# EasyEDA Pro project ProPrj_STM32_extender.epro

# Schematic Schematic1
Board Name: Board1; Create Date: 2024-09-02
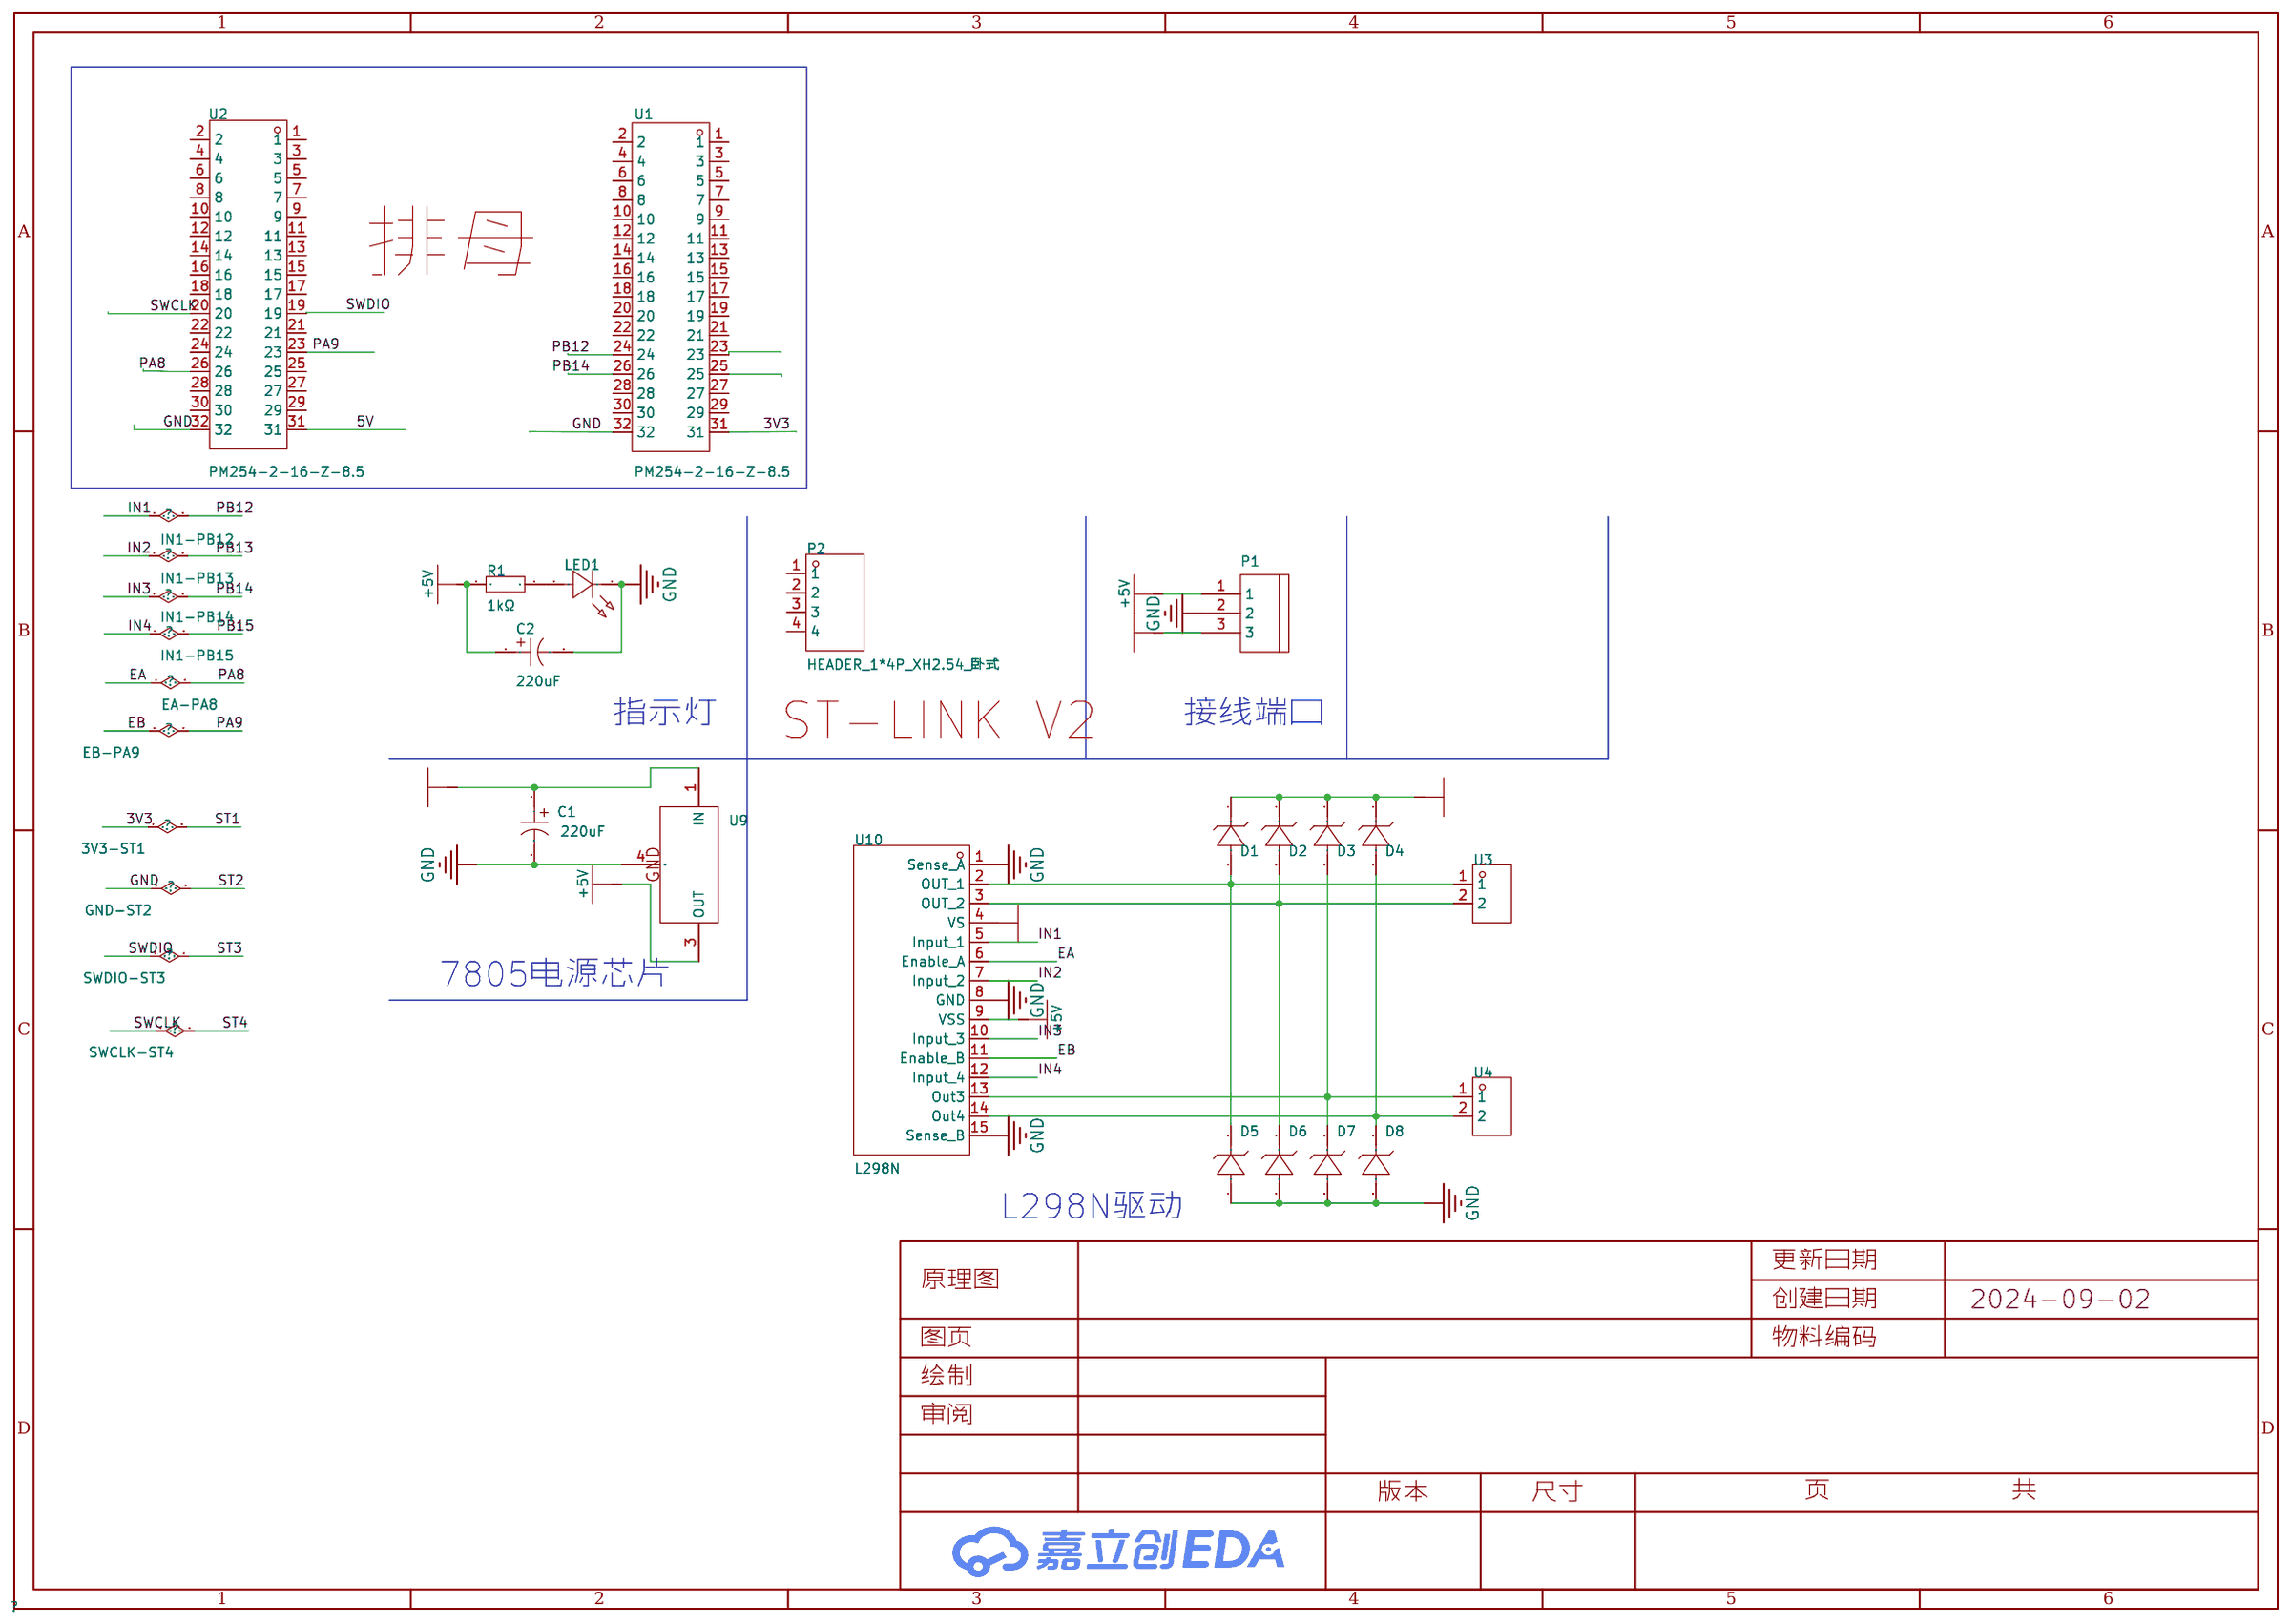
[diagram p0: schematic sheet]

## Parts
C1  220uF  [CAP-SMD_BD8.0-L8.3-W8.3-LS9.3-FD]
C2  220uF  [CAP-SMD_BD8.0-L8.3-W8.3-LS9.3-FD]
D1  -  [SOD-123FL_L2.7-W1.8-LS3.8-RD]
D2  -  [SOD-123FL_L2.7-W1.8-LS3.8-RD]
D3  -  [SOD-123FL_L2.7-W1.8-LS3.8-RD]
D4  -  [SOD-123FL_L2.7-W1.8-LS3.8-RD]
D5  -  [SOD-123FL_L2.7-W1.8-LS3.8-RD]
D6  -  [SOD-123FL_L2.7-W1.8-LS3.8-RD]
D7  -  [SOD-123FL_L2.7-W1.8-LS3.8-RD]
D8  -  [SOD-123FL_L2.7-W1.8-LS3.8-RD]
LED1  -  [LED0805-RD_BLUE]
P1  -  [CONN-TH_3P-P5.00_WJ500V-5.08-3P]
P2  HEADER_1*4P_XH2.54_卧式  [HDR-TH_4P-P2.54-H-M-W11.0]
R1  1kΩ  [R0805]
U1  PM254-2-16-Z-8.5  [HDR-TH_32P-P2.54-V-F-R2-C16-S2.54]
U2  PM254-2-16-Z-8.5  [HDR-TH_32P-P2.54-V-F-R2-C16-S2.54]
U3  -  [CONN-TH_DB302-5.0-2P]
U4  -  [CONN-TH_DB302-5.0-2P]
U9  L78M05ABDT-TR  [TO-252-2_L6.5-W6.1-P4.58-LS10.0-TL]
U10  L298N  [MULTIWATT-15_L19.6-W5.0-P1.27-L]

## Library data of the parts
C1 C2 = EMK1VM221FB0D00R: 容值:220uF;精度:±20%;额定电压:35V;电容体直径:-;电容体长度:-;纹波电流:-;等效串联电阻:-;工作寿命:-;工作温度:-;; LCSC Part Name: 220uF ±20% 35V; Supplier Part: C724731; Manufacturer: AISHI(艾华集团); Supplier Footprint: SMD,8x10.5mm; JLCPCB Part Class: Extended Part; Datasheet: https://atta.szlcsc.com/upload/public/pdf/source/20200818/C724731_E3C3C738DF50876976EE53B5D20E1717.pdf; Supplier: LCSC; Tolerance: ±20%; Rated Voltage: 35V
D1-D8 = 1N4007: 二极管配置:独立式;直流反向耐压(Vr):1kV;平均整流电流(Io):1A;正向压降(Vf):1.1V@1A;反向电流(Ir):10A@1kV;; LCSC Part Name: 1kV 1A 1.1V@1A; Supplier Part: C727082; Manufacturer: TWGMC(台湾迪嘉); Supplier Footprint: SOD-123FL; JLCPCB Part Class: Extended Part; Datasheet: https://atta.szlcsc.com/upload/public/pdf/source/20200828/C727082_2F914037E829F0E2238583225D7ED281.pdf; Supplier: LCSC; Diode Configuration: 独立式; Reverse Voltage (Vr): 1kV; Average Rectified Current (Io): 1A; Forward Voltage (Vf@If): 1.1V@1A; Reverse Leakage Current: 10A@1kV
LED1 = RF-BGB170TS-CB-E0: 发光颜色:蓝灯;二极管配置:-;透镜颜色:-;主波长:-;峰值波长:-;色温:-;光通量(25时):-;测试电流:20mA;正向电压(VF):-;发光强度:-;功率:70mW;发光角度:140°;安装方式:正贴;工作温度:-40~+85;; LCSC Part Name: 蓝灯 正贴; Supplier Part: C2908306; Manufacturer: Refond(瑞丰); Supplier Footprint: 0805; JLCPCB Part Class: Extended Part; Datasheet: https://atta.szlcsc.com/upload/public/pdf/source/20211101/C871A18E9B6E101B84BDF0C661245F86.pdf; Supplier: LCSC; Emitted Color: 蓝灯; Forward Current: 20mA; Power Dissipation: 70mW; Viewing Angle: 140°; Mounting Sytle: 正贴; Operating Temperature: -40~+85
P1 = WJ500V-5.08-3P: 间距:5.08mm;排数:1;每排PIN数:3;安装方式:直针;额定电流:18A;额定电压:250V;线规 - AWG:14~30;线规 - mm?:2.5;工作温度范围:-40~+105;颜色:绿色;; LCSC Part Name: 5.08mm 排数:1 每排P数:3 直针 可拼接; Supplier Part: C72334; Manufacturer: KANGNEX(康奈克斯电气); Supplier Footprint: P=5.08mm; JLCPCB Part Class: Extended Part; Datasheet: https://atta.szlcsc.com/upload/public/pdf/source/20191225/C72334_8A5EF831D67650233B6B1E3F2BC06274.pdf; Supplier: LCSC; Pitch: 5.08mm; Number of Rows: 1; Number of PINs Per Row: 3; Mounting Style: 直针; Current Rating (Max): 18A; Voltage Rating (Max): 250V; Wire Gauge - AWG: 14~30; Wire Gauge - mm?: 2.5; Operating Temperature Range: -40~+105; Color: 绿色
P2 = HEADER_1*4P_XH2.54_卧式: Supplier Part: C9900003188; Supplier Footprint: ST-Link; JLCPCB Part Class: 扩展库; Supplier: LCSC
R1 = RS-05K102JT: 阻值:1kΩ;精度:±5%;功率:125mW;温度系数:±100ppm/;最大工作电压:150V;工作温度范围:-55~+155;; LCSC Part Name: 1kΩ ±5%; Supplier Part: C115302; Manufacturer: FH(风华); Supplier Footprint: 0805; JLCPCB Part Class: Extended Part; Datasheet: https://atta.szlcsc.com/upload/public/pdf/source/20170704/1499151304704.pdf; Supplier: LCSC; Tolerance: ±5%; Power(Watts): 125mW; Temperature Coefficient: ±100ppm/; Overload Voltage (Max): 150V; Operating Temperature Range: -55~+155
U1 U2 = PM254-2-16-Z-8.5: 插孔结构:2x16P;间距:2.54mm;行距:2.54mm;圆孔/方孔:方孔;安装类型:直插;排数:双排;总孔位数:32P;额定电流:3A;额定电压:-;插孔方向:顶部;塑高:8.5mm;触头材质:铜合金;工作温度范围:-40℃~+105℃;焊接温度(最大值):260℃@5S;; LCSC Part Name: 2x16P 间距:2.54mm 直插; Supplier Part: C2897417; Manufacturer: HCTL(华灿天禄); Supplier Footprint: 插件,P=2.54mm; JLCPCB Part Class: 扩展库; Datasheet: https://atta.szlcsc.com/upload/public/pdf/source/20230609/3D36CA2C1BFC9FD1C3F709AD9DFEB9C2.pdf; Supplier: LCSC; Holes Structure: 2x16P; Pitch: 2.54mm; Row Spacing: 2.54mm; Circular Hole / Square Hole: 方孔; Mounting Type: 直插; Number of Rows: 双排; Number of Holes: 32P; Current Rating (Max): 3A; Holes Direction: 顶部; Insulation Height: 8.5mm; Contact Material: 铜合金; Operating Temperature Range: -40℃~+105℃; Soldering Temperature(Max): 260℃@5S
U3 U4 = DB302-5.0-2P-GN-S: LCSC Part Name: 2P P=5mm; Supplier Part: C2997275; Manufacturer: DIBO(地博电气); Supplier Footprint: P=5mm; JLCPCB Part Class: Extended Part; Datasheet: https://atta.szlcsc.com/upload/public/pdf/source/20220418/F63E4822E301FF035E2D9136E480A4B5.pdf; Supplier: LCSC
U9 = L78M05ABDT-TR: L78M Series 500 mA 5 V Three Terminal Positive Voltage LDO Regulator - TO-252; Supplier Part: C58069; Manufacturer: ST(意法半导体); Supplier Footprint: TO-252-2(DPAK); JLCPCB Part Class: Basic Part; Datasheet: https://atta.szlcsc.com/upload/public/pdf/source/20150912/1457707362652.pdf; Supplier: LCSC
U10 = L298N_C19922: 电源电压:4.5V~7V;特性:过流保护(OCP)；过热保护(OPT);; Supplier Part: C19922; Manufacturer: ST(意法半导体); Supplier Footprint: Multiwatt-15-V; JLCPCB Part Class: Extended Part; Datasheet: https://atta.szlcsc.com/upload/public/pdf/source/20131014/1457706655076.pdf; Supplier: LCSC; Supply Voltage: 4.5V~7V; Feature: 过流保护(OCP)；过热保护(OPT); Operating Temperature: -40℃~+150℃@(Tj)

## Nets
3V3: U1.31
5V: U2.31
12V: C1.1 D1.1(K) D2.1(K) D3.1(K) D4.1(K) P1.3 U9.1(IN) U10.4(VS)
+5V: C2.1 P1.1 R1.2 U9.3(OUT) U10.9(VSS)
GND: C1.2 C2.2 D5.2(A) D6.2(A) D7.2(A) D8.2(A) LED1.1(K) P1.2 U1.32 U2.32 U9.4(GND) U10.1(Sense A) U10.8(GND) U10.15(Sense B)
EA: U2.26 U10.6(Enable A)
EB: U2.23 U10.11(Enable B)
IN1: U1.24 U10.5(Input 1)
IN2: U10.7(Input 2)
IN3: U1.26 U10.10(Input 3)
IN4: U10.12(Input 4)
ST3: U2.19
ST4: U2.20
$1N2794: D3.2(A) D7.1(K) U4.1 U10.13(Out3)
$1N2795: D4.2(A) D8.1(K) U4.2 U10.14(Out4)
$1N2797: D1.2(A) D5.1(K) U3.1 U10.2(OUT 1)
$1N2798: D2.2(A) D6.1(K) U3.2 U10.3(OUT 2)
$1N2826: LED1.2(A) R1.1

Not connected (* = marked no-connect by the designer): P2 1 2 3 4; U1 1 2 3 4 5 6 7 8 9 10 11 12 13 14 15 16 17 18 19 20 21 22 23 25 27 28 29 30; U2 1 2 3 4 5 6 7 8 9 10 11 12 13 14 15 16 17 18 21 22 24 25 27 28 29 30

## Notes on the sheet
- 排母
- 指示灯
- 接线端口
- ST-LINK V2
- 7805电源芯片
- L298N驱动

# Board PCB1
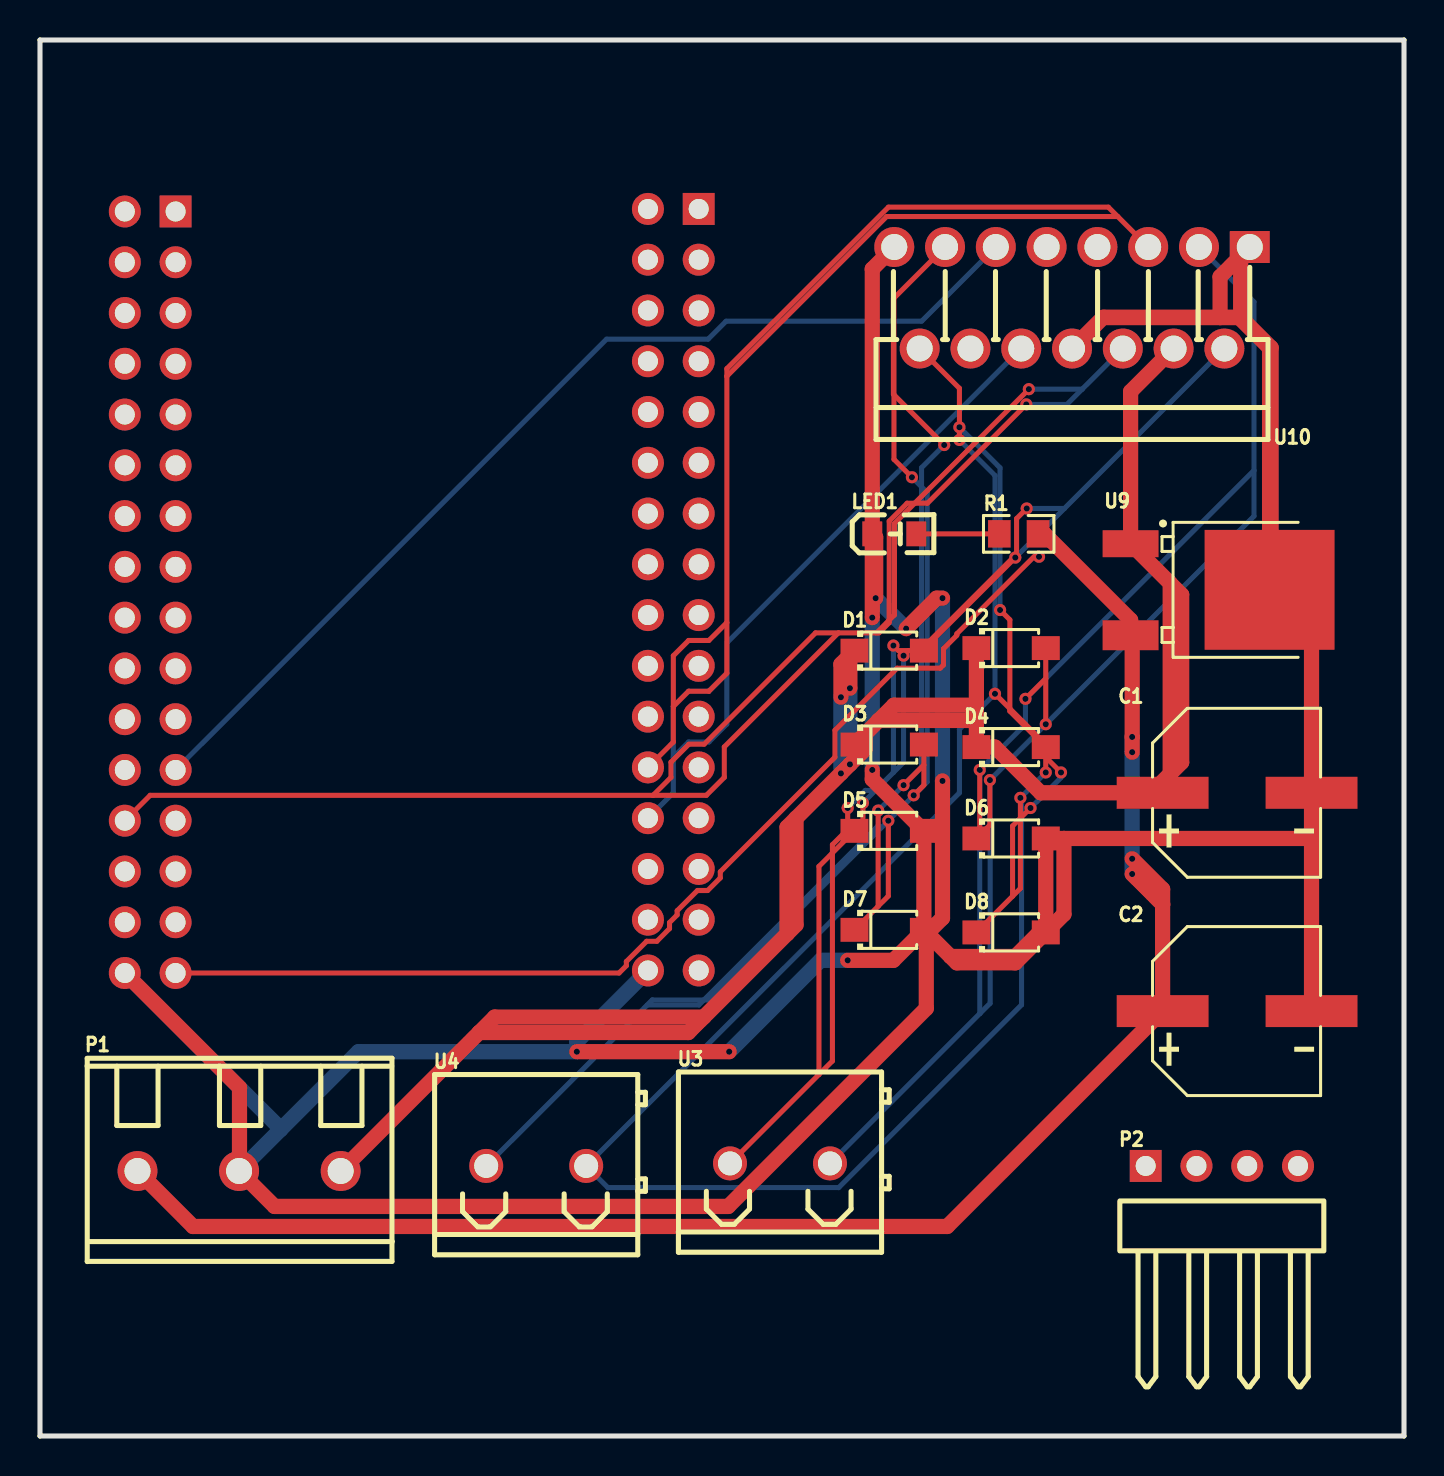
[diagram p1: board, top side]
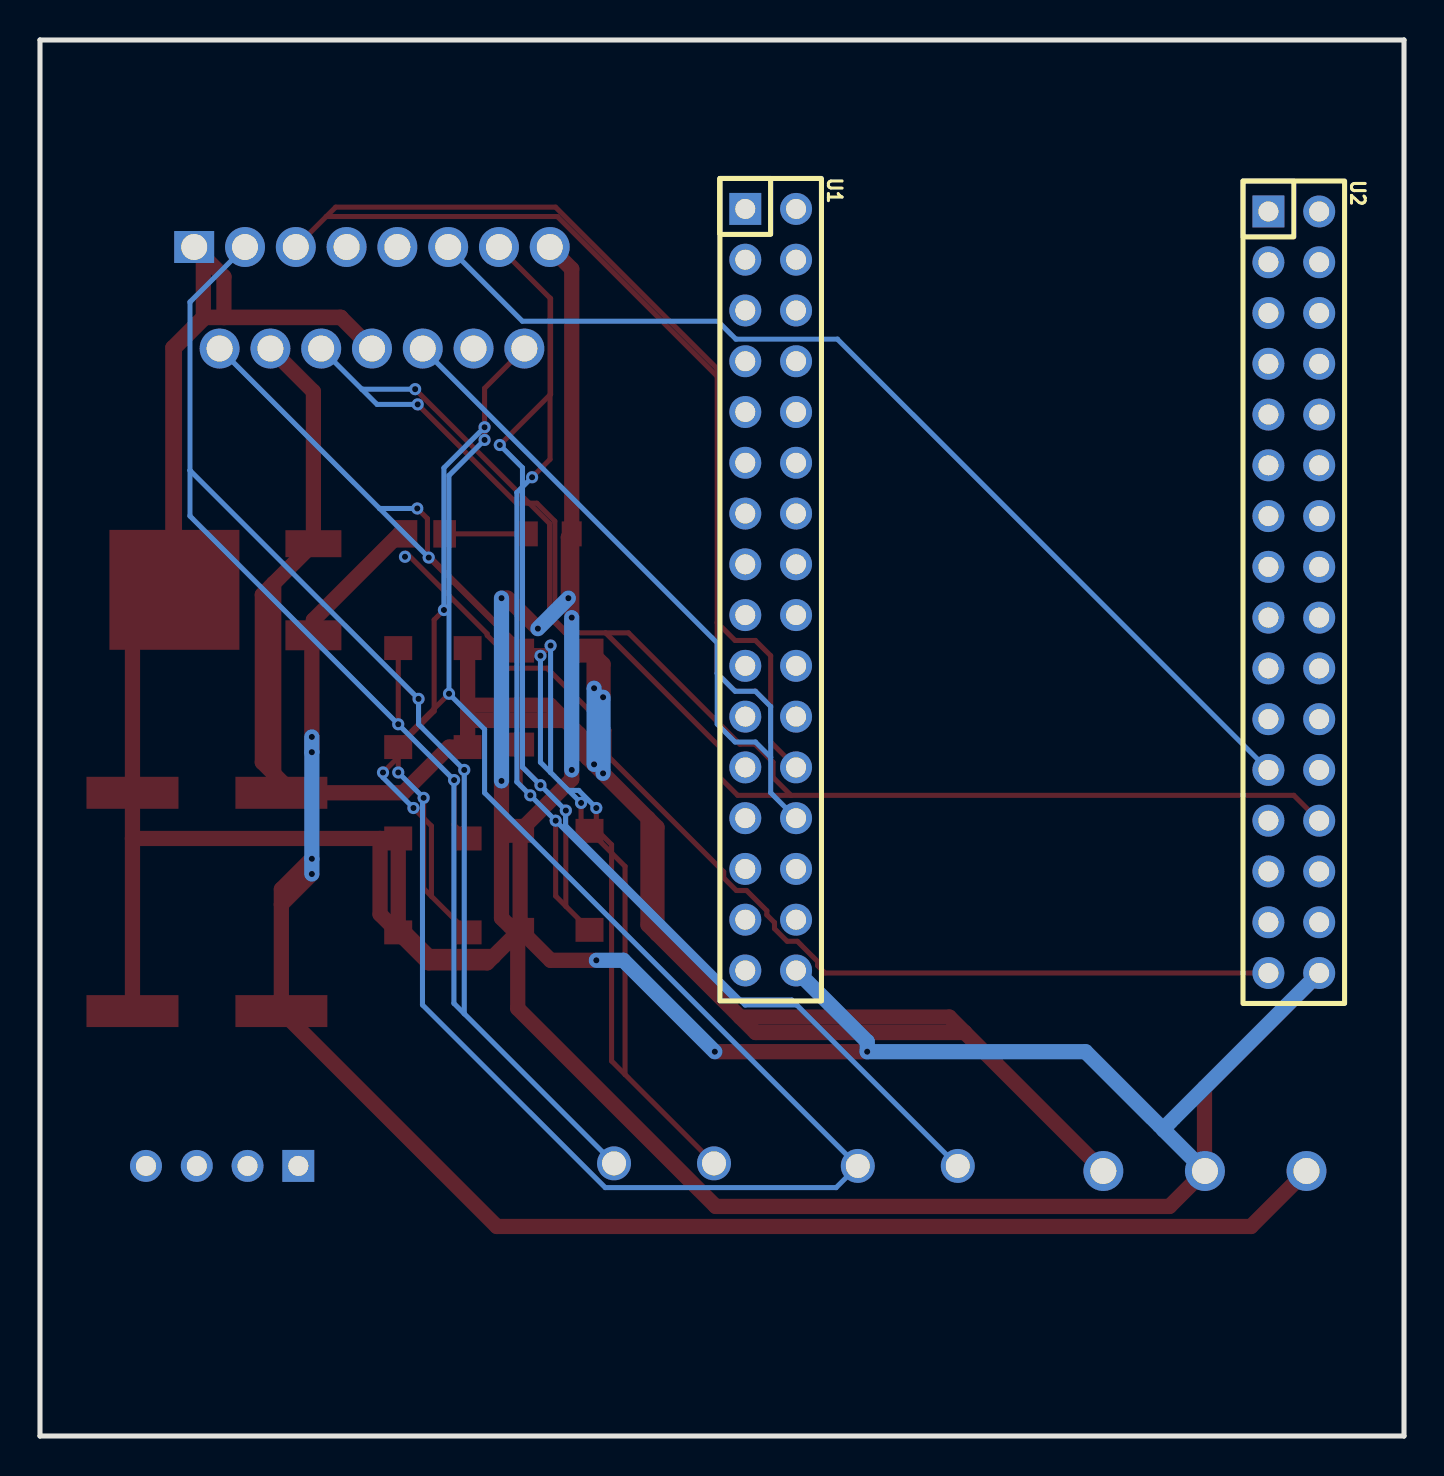
[diagram p2: board, bottom side, seen from below]

Outline 68.22 x 69.84 mm; copper layers: Top Layer, Bottom Layer. Coordinates in mm from the lower left corner of the outline.
Outline path: 0,69.84 68.22,69.84 68.22,0 0,0 0,69.84
Stack: Top Layer 0.035mm / Dielectric1 1.51mm FR4 er 4.5 / Bottom Layer 0.035mm

## Design rules (mm)
template: 自定义配置
spacing copperThickness1oz (default): track to track 0.102, other pairs 0.152 to 0.3
spacing copperThickness2oz: track to track 0.203, other pairs 0.152 to 0.3
track width copperThickness1oz (default): min 0.127, default 0.254, max 2.54
track width copperThickness2oz: min 0.203, default 0.254, max 2.54
track width thick: min 0.762, default 0.762, max 2.54
differential pair differentialPair (default): width min 0.127, default 0.254, max 2.54; gap min 0.152, default 0.152
via viaSize (default): diameter min 0.5, default 0.61, max 10; hole min 0.3, default 0.305, max 6.3
net 12V uses thick
net GND uses thick
net +5V uses thick
net 5V uses thick

## Placement (name value [footprint] x y rotation side)
C1  220uF  [CAP-SMD_BD8.0-L8.3-W8.3-LS9.3-FD]  59.87 32.18 0 top
C2  220uF  [CAP-SMD_BD8.0-L8.3-W8.3-LS9.3-FD]  59.87 21.26 0 top
D1  -  [SOD-123FL_L2.7-W1.8-LS3.8-RD]  42.47 39.29 0 top
D2  -  [SOD-123FL_L2.7-W1.8-LS3.8-RD]  48.57 39.42 0 top
D3  -  [SOD-123FL_L2.7-W1.8-LS3.8-RD]  42.47 34.59 0 top
D4  -  [SOD-123FL_L2.7-W1.8-LS3.8-RD]  48.57 34.47 0 top
D5  -  [SOD-123FL_L2.7-W1.8-LS3.8-RD]  42.47 30.28 0 top
D6  -  [SOD-123FL_L2.7-W1.8-LS3.8-RD]  48.57 29.9 0 top
D7  -  [SOD-123FL_L2.7-W1.8-LS3.8-RD]  42.47 25.32 0 top
D8  -  [SOD-123FL_L2.7-W1.8-LS3.8-RD]  48.57 25.2 0 top
LED1  -  [LED0805-RD_BLUE]  42.72 45.14 0 top
P1  -  [CONN-TH_3P-P5.00_WJ500V-5.08-3P]  9.96 13.26 0 top
P2  HEADER_1*4P_XH2.54_卧式  [HDR-TH_4P-P2.54-H-M-W11.0]  59.11 13.51 0 top
R1  1kΩ  [R0805]  48.95 45.14 0 top
U1  PM254-2-16-Z-8.5  [HDR-TH_32P-P2.54-V-F-R2-C16-S2.54]  31.67 42.34 270 bottom
U2  PM254-2-16-Z-8.5  [HDR-TH_32P-P2.54-V-F-R2-C16-S2.54]  5.51 42.21 270 bottom
U3  -  [CONN-TH_DB302-5.0-2P]  37.01 13.64 0 top
U4  -  [CONN-TH_DB302-5.0-2P]  24.82 13.51 0 top
U9  L78M05ABDT-TR  [TO-252-2_L6.5-W6.1-P4.58-LS10.0-TL]  58.02 42.35 0 top
U10  L298N  [MULTIWATT-15_L19.6-W5.0-P1.27-L]  51.61 56.95 180 top

## Footprints (pads in the part's own frame, mm; a bottom-side part is the same pattern mirrored in y, then rotated)
CAP-SMD_BD8.0-L8.3-W8.3-LS9.3-FD
  rect 4.6x1.6 smd: 1(-3.724,0) 2(3.724,0)
CONN-TH_3P-P5.00_WJ500V-5.08-3P
  round 1.999 hole 1.3: 1(-5.08,0) 2(0,0) 3(5.08,0)
CONN-TH_DB302-5.0-2P
  round 1.7 hole 1.2: 1(-2.5,0) 2(2.5,0)
HDR-TH_4P-P2.54-H-M-W11.0
  rect 1.6x1.6 hole 1: 1(-3.81,0)
  round 1.6 hole 1: 2(-1.27,0) 3(1.27,0) 4(3.81,0)
HDR-TH_32P-P2.54-V-F-R2-C16-S2.54
  rect 1.6x1.6 hole 1: 1(-19.05,-1.27)
  round 1.6 hole 1: 2(-19.05,1.27) 3(-16.51,-1.27) 4(-16.51,1.27) 5(-13.97,-1.27) 6(-13.97,1.27) 7(-11.43,-1.27) 8(-11.43,1.27) 9(-8.89,-1.27) 10(-8.89,1.27) 11(-6.35,-1.27) 12(-6.35,1.27) 13(-3.81,-1.27) 14(-3.81,1.27) 15(-1.27,-1.27) 16(-1.27,1.27) 17(1.27,-1.27) 18(1.27,1.27) 19(3.81,-1.27) 20(3.81,1.27) 21(6.35,-1.27) 22(6.35,1.27) 23(8.89,-1.27) 24(8.89,1.27) 25(11.43,-1.27) 26(11.43,1.27) 27(13.97,-1.27) 28(13.97,1.27) 29(16.51,-1.27) 30(16.51,1.27) 31(19.05,-1.27) 32(19.05,1.27)
LED0805-RD_BLUE
  rect 1.001x1.25 smd: 1(-1.1,0) 2(1.1,0)
MULTIWATT-15_L19.6-W5.0-P1.27-L
  rect 2x1.6 hole 1.3: 1(-8.89,-2.54)
  round 2 hole 1.3: 2(-7.62,2.54) 3(-6.35,-2.54) 4(-5.08,2.54) 5(-3.81,-2.54) 6(-2.54,2.54) 7(-1.27,-2.54) 8(0,2.54) 9(1.27,-2.54) 10(2.54,2.54) 11(3.81,-2.54) 12(5.08,2.54) 13(6.35,-2.54) 14(7.62,2.54) 15(8.89,-2.54)
R0805
  rect 1.133x1.377 smd: 1(-0.966,0) 2(0.966,0)
SOD-123FL_L2.7-W1.8-LS3.8-RD
  rect 1.399x1.199 smd: 1(-1.735,0) 2(1.735,0)
TO-252-2_L6.5-W6.1-P4.58-LS10.0-TL
  rect 2.8x1.35 smd: 1(-3.475,2.29)
  rect 2.8x1.5 smd: 3(-3.475,-2.29)
  rect 6.5x6 smd: 4(3.475,-0.017)

## Nets
As in the schematic.

Pads without a net: P2 1 2 3 4; U1 1 2 3 4 5 6 7 8 9 10 11 12 13 14 15 16 17 18 19 20 21 22 27 28 29 30; U2 1 2 3 4 5 6 7 8 9 10 11 12 13 14 15 16 17 18 21 22 24 25 27 28 29 30

## Via types
v1: diameter 0.61, hole 0.305, Top Layer to Bottom Layer, 44 vias

## Routing (per net, layer and track width the routed paths; a pad name or vN(x,y) marks a point on that pad's centre or on a via; arc(x,y) is an arc through that point)
5V: length 53.8
  Top Layer w0.254: 49.96,44.17 49.88,44.17 45.85,40.14 45.85,40.06 45.18,39.39 45.18,38.58 45.02,38.42 42.86,38.42 39.76,35.31 39.76,33.96 34.02,28.23 34.02,27.92 33.39,27.29 32.88,27.29 31.86,26.28 31.86,26.07 31.48,25.69 31.48,25.38 30.85,24.75 30.34,24.75 29.33,23.74 29.33,23.53 28.96,23.16 U2.31
  vias: v1(49.96,43.99)
12V: length 131.6
  Top Layer w0.762: 41.27,35.13 41.27,34.37 40.82,33.92 ; 41.27,35.13 40.82,34.68 ; 41.27,35.13 41.94,35.8 ; 55.57,32.18 56.53,33.13 ; 55.57,32.18 55.76,32.18 ; 55.57,32.18 50.05,32.18 47.76,34.47 D4.1 46.83,35.8 ; 56.53,33.13 56.53,32.94 55.76,32.18 ; 56.53,33.13 56.53,42.66 ; 56.53,33.13 57.1,33.71 57.1,42.09 56.53,42.66 ; 33.2,20.96 32.42,20.19 21.97,20.19 ; 33.2,20.96 37.36,25.13 ; 33.2,20.96 22.74,20.96 21.97,20.19 ; 40.51,39.06 D1.1 ; 40.51,39.06 v1(40.51,37.41) ; 40.51,39.06 40.05,38.61 v1(40.05,36.96) ; 55.76,32.18 C1.1 ; 40.82,33.92 40.82,34.68 ; 40.82,33.92 v1(40.51,33.6) v1(40.05,33.15) 37.81,30.91 ; 21.97,20.19 P1.3 ; 37.36,25.13 37.36,30.46 37.81,30.91 ; 37.36,25.13 37.81,25.58 37.81,30.91 ; 40.82,34.68 D3.1 ; 46.83,36.56 D2.1 ; 46.83,36.56 46.83,35.8 ; 46.83,36.56 42.7,36.56 41.94,35.8 ; 56.53,42.66 U9.1 54.54,52.26 U10.4 ; 46.83,35.8 41.94,35.8
  Bottom Layer w0.762: v1(40.51,33.6) v1(40.51,37.41) ; v1(40.05,33.15) v1(40.05,36.96)
+5V: length 87.2
  Top Layer w0.762: 56.14,26.59 56.14,27.36 v1(54.62,28.88) ; 56.14,26.59 C2.1 45.37,10.48 7.65,10.48 P1.1 ; 56.14,26.59 v1(54.62,28.12) ; R1.2 50.23,45.14 54.54,40.82 U9.3 54.62,39.98 v1(54.62,34.98) v1(54.62,34.21)
  Bottom Layer w0.762: v1(54.62,34.98) v1(54.62,34.21) v1(54.62,28.88) v1(54.62,28.12)
GND: length 281.3
  Top Layer w0.762: 44.33,25.2 44.33,21.39 34.42,11.49 11.73,11.49 9.98,13.24 ; 44.33,25.2 44.37,25.15 ; 44.33,25.2 D7.2 ; 59.02,55.96 59.02,55.97 ; 59.02,55.96 59.97,55.96 61.49,54.43 U9.4 61.57,42.26 ; 59.02,55.96 53.16,55.96 ; 59.02,55.97 60.05,55.97 ; 59.02,55.97 53.18,55.97 53.16,55.96 ; 59.02,55.97 59.02,58 60.05,59.03 ; v1(45.14,32.77) 45.14,25.92 44.37,25.15 ; v1(41.62,40.94) LED1.1 ; LED1.1 41.62,58.39 U10.15 ; LED1.1 41.79,44.97 v1(41.79,41.92) ; 61.57,42.26 61.57,54.45 60.05,55.97 ; 61.57,42.26 63.59,40.24 C1.2 63.59,29.9 ; 45.54,23.99 48.78,23.99 50.3,25.51 ; 45.54,23.99 44.37,25.15 ; 45.54,23.99 45.86,23.67 48.78,23.67 D8.2 ; 53.16,55.96 U10.8 ; 60.05,55.97 60.05,59.03 ; 51.21,29.9 51.21,26.11 D8.2 ; 51.21,29.9 63.59,29.9 ; 51.21,29.9 D6.2 50.3,25.51 ; 60.05,59.03 U10.1 ; 50.3,25.51 D8.2 ; 9.98,13.24 9.98,17.43 U2.32 ; 9.98,13.24 P1.2 ; D7.2 42.68,23.8 v1(40.39,23.8) ; D7.2 D5.2 41.62,32.86 v1(41.62,33.32) ; 63.59,29.9 C2.2 ; v1(43.32,40.39) 44.84,41.92 v1(45.14,41.92) ; v1(34.47,19.23) v1(26.85,19.23)
  Bottom Layer w0.762: v1(34.47,19.23) 39.04,23.8 v1(40.39,23.8) ; v1(43.32,40.39) v1(41.79,41.92) ; 30.4,23.29 26.85,19.74 v1(26.85,19.23) 15.93,19.23 12.02,15.32 ; 12.02,15.32 P1.2 ; 12.02,15.32 12.02,15.39 U2.32 ; v1(41.62,33.32) v1(41.62,40.94) ; v1(45.14,32.77) v1(45.14,41.92)
EA: length 94.7
  Top Layer w0.254: 43.75,46.67 v1(49.45,52.37) ; 43.75,46.67 42.73,45.65 42.73,41.08 42.47,40.82 ; 43.75,46.67 44.38,46.67 v1(49.33,51.61) ; 43.75,46.67 43.37,46.67 42.47,45.77 42.47,40.82 ; U2.26 5.51,32.05 30.66,32.05 ; 42.47,40.82 41.83,40.18 ; 42.47,40.82 42.47,40.69 41.96,40.18 41.83,40.18 ; 41.83,40.18 39.93,40.18 ; 30.66,32.05 33.33,32.05 34.22,32.95 34.22,34.48 39.93,40.18 ; 30.66,32.05 31.56,32.95 31.56,33.71 32.45,34.61 33.22,34.61 38.79,40.18 39.93,40.18
  Bottom Layer w0.254: v1(49.45,52.37) 52.12,52.37 ; 52.12,52.37 U10.6 ; 52.12,52.37 51.36,51.61 v1(49.33,51.61)
EB: length 51.9
  Bottom Layer w0.254: U10.11 44.09,55.78 34.31,55.78 33.41,54.88 28.33,54.88 U2.23
IN1: length 76.2
  Top Layer w0.254: 34.35,53.02 42.34,61.01 53.9,61.01 ; 34.35,53.02 34.35,53.4 42.43,61.48 53.43,61.48 53.9,61.01 ; 34.35,53.02 34.35,40.7 ; 31.67,36.5 31.67,34.72 30.4,33.45 ; 31.67,36.5 32.44,37.26 33.45,37.26 34.35,38.16 34.35,40.7 ; 31.67,36.5 31.67,39.04 32.44,39.8 33.45,39.8 34.35,40.7 ; 53.9,61.01 U10.5
IN3: length 37.7
  Bottom Layer w0.254: 31.67,33.96 32.44,34.72 33.45,34.72 34.35,35.62 34.35,38.16 ; 31.67,33.96 31.67,36.5 32.44,37.26 33.45,37.26 34.35,38.16 ; 31.67,33.96 31.67,32.18 30.4,30.91 ; 34.35,38.16 34.35,39.68 U10.10
$1N2794: length 117.8
  Top Layer w0.254: 42.71,52.09 42.71,56.93 ; 42.71,52.09 42.68,52.12 42.68,56.9 42.71,56.93 ; 42.71,52.09 42.71,48.86 v1(43.61,47.97) ; 42.71,52.09 v1(45.22,49.58) ; 42.71,56.93 U10.13 ; 44.2,33.58 44.2,32.56 v1(43.7,32.05) ; 44.2,33.58 D3.2 ; 44.2,33.58 v1(43.19,32.56) ; v1(41.92,31.29) 41.92,26.51 ; 41.92,26.51 D7.1 ; 41.92,26.51 42.43,27.02 v1(42.43,30.78)
  Bottom Layer w0.254: 44.09,47.49 v1(43.61,47.97) ; 44.09,47.49 44.09,48.45 v1(45.22,49.58) ; 44.09,47.49 44.37,47.2 44.37,32.73 v1(43.7,32.05) v1(42.43,30.78) 33.46,21.82 33.2,21.82 ; 44.09,47.49 44.09,33.46 v1(43.19,32.56) 41.93,31.31 ; 33.2,21.82 30.62,21.82 30.37,21.56 ; 33.2,21.82 41.93,30.54 41.93,31.31 ; 33.2,21.82 32.95,21.56 30.37,21.56 ; 41.93,31.31 v1(41.92,31.29) ; 30.37,21.56 U4.1
$1N2795: length 127.8
  Top Layer w0.254: 48.64,27.01 49.03,27.4 49.03,30.91 ; 48.64,27.01 D8.1 ; 48.64,27.01 48.64,30.52 49.03,30.91 ; 48.5,36.39 48.5,36.26 D4.2 ; 48.5,36.39 50.3,34.59 D4.2 ; 48.5,36.39 48.5,40.84 v1(48.01,41.33) ; 48.5,36.39 v1(47.76,37.13) ; D4.2 50.3,33.96 ; 50.3,33.96 v1(51.06,33.2) ; 50.3,33.96 v1(50.3,33.2) ; 49.03,30.91 v1(49.03,31.93) ; 49.03,30.91 v1(49.54,31.42) ; v1(45.98,49.83) v1(45.98,50.47) 45.98,52.42 U10.14
  Bottom Layer w0.254: 49.09,31.99 v1(49.03,31.93) ; 49.09,31.99 49.09,21.57 39.94,12.43 28.4,12.43 U4.2 45.98,32.18 45.98,35.36 v1(47.76,37.13) 47.76,48.06 v1(45.98,49.83) ; 49.09,31.99 v1(50.3,33.2) ; v1(51.06,33.2) 51.06,32.94 v1(49.54,31.42) ; v1(48.01,41.33) 48.01,48.44 v1(45.98,50.47)
$1N2797: length 86
  Top Layer w0.254: D5.1 39.63,29.17 ; D5.1 40.53,30.48 ; D5.1 41.16,30.7 v1(41.16,31.67) ; 39.63,29.17 39.63,29.58 40.53,30.48 ; 39.63,29.17 38.96,28.5 38.96,18.09 ; 39.63,29.17 39.63,18.76 38.96,18.09 ; 43.44,39.29 42.93,39.29 v1(42.68,39.55) ; 43.44,39.29 44.01,39.29 ; 43.44,39.29 v1(43.19,39.04) ; 40.53,30.48 40.39,30.62 v1(40.39,31.42) ; 38.96,18.09 U3.1 ; 44.01,39.29 D1.2 44.2,39.38 v1(48.78,43.95) ; 44.01,39.29 48.84,44.12 48.84,45.9 v1(49.35,46.41)
  Bottom Layer w0.254: 41.78,32.3 v1(41.16,31.67) ; 41.78,32.3 42.68,33.2 ; 41.78,32.3 41.27,32.3 v1(40.39,31.42) ; v1(48.78,43.95) 51.23,46.41 ; 51.23,46.41 v1(49.35,46.41) ; 51.23,46.41 U10.2 ; 42.68,33.2 43.19,33.71 v1(43.19,39.04) ; 42.68,33.2 v1(42.68,39.55)
$1N2798: length 100.4
  Top Layer w0.254: 47,30.06 47.51,30.57 v1(47.51,32.82) ; 47,30.06 D6.1 ; 47,30.06 v1(47,33.32) ; 50.3,37.9 v1(50.3,35.61) ; 50.3,37.9 D2.2 ; 50.3,37.9 v1(49.28,36.88)
  Bottom Layer w0.254: 47,21.13 U3.2 ; 47,21.13 v1(47,33.32) 49.28,35.61 v1(49.28,36.88) 60.71,48.31 ; 47,21.13 47.52,21.65 47.52,32.83 ; 47.52,32.83 v1(50.3,35.61) 60.71,46.02 60.71,48.31 ; 47.52,32.83 v1(47.51,32.82) ; U10.3 60.71,56.74 60.71,48.31
$1N2826: length 4.2
  Top Layer w0.254: LED1.2 R1.1
